# Altium project DKS.PrjPcb
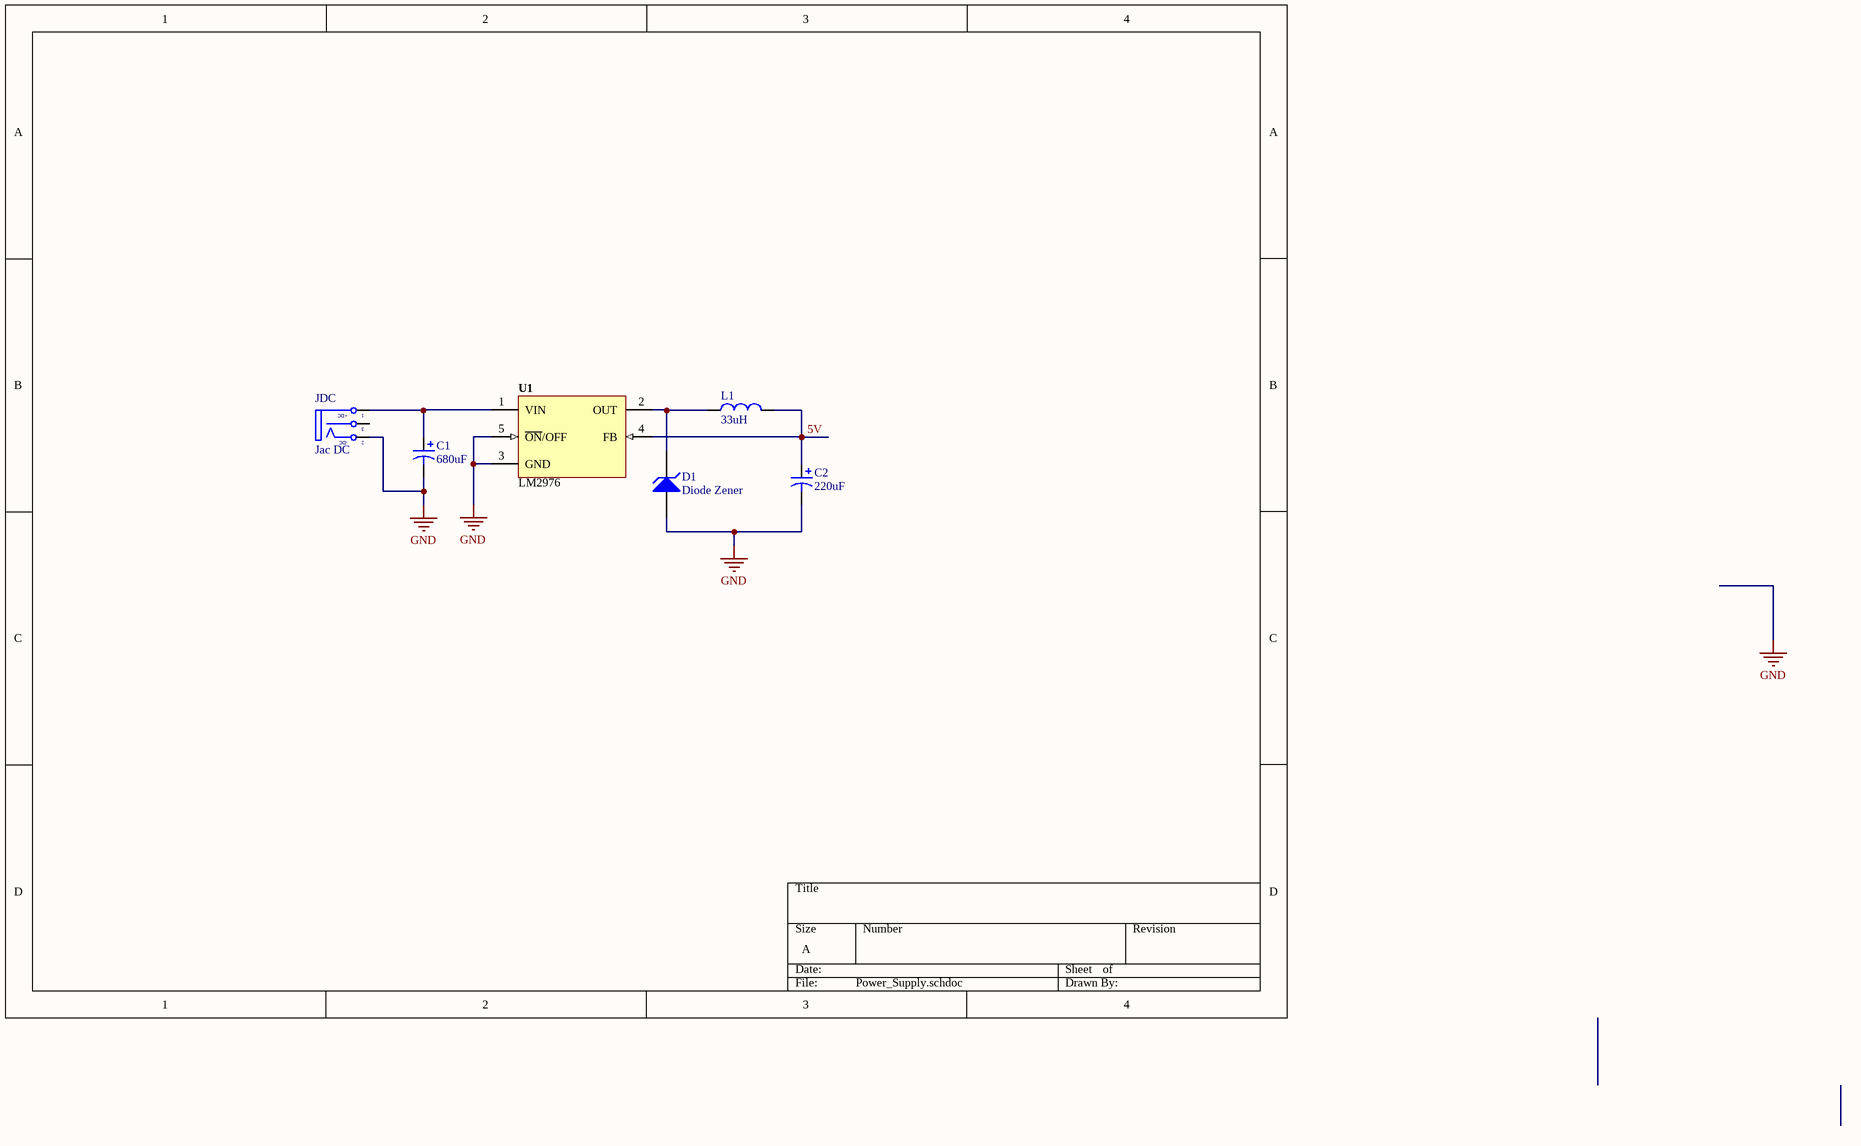
[diagram p0: Power_Supply.schdoc]
6 sheets, 59 parts. Net scope: global (net labels, ports and power ports of the same name join across sheets).
Board file: DigitalControl.PcbDoc
Sheets:
  Power_Supply.schdoc
  Driver.SchDoc
  IGBT.SchDoc
  Filter_Load.SchDoc
  Current_Voltage_Sensor.SchDoc
  MCU.SchDoc

## Sheet Power_Supply.schdoc
size A; SheetNumber: 1; SheetTotal: 6

### Parts
C1  680uF  [C5mm]
C2  220uF  [C5mm]
D1  Diode Zener  [SMA]
JDC  Jac DC  [DC0]
L1  33uH  [L-SMD-M-7.3x4.5]
U1  LM2976  [TO263]

### Nets
5V: C2.1 L1.2 U1.4(FB)
GND: C1.2 C2.2 D1.1(A) JDC.2(TN) U1.3(GND) U1.5(~{ON}/OFF)
NetC1_1: C1.1 JDC.1(T) U1.1(VIN)
NetD1_2: D1.2(K) L1.1 U1.2(OUT)

Not connected (* = marked no-connect by the designer): JDC 3(S)

### Notes on the sheet
- (in symbol DCIN) +DC; -DC

### Library data of the parts
C1 C2 = Cap Pol 5mm: Polarized Capacitor (Axial); Published: 8-Jun-2000; LatestRevisionDate: 17-Jul-2002; LatestRevisionNote: Re-released for DXP Platform.; PackageReference: POLAR0.8; Publisher: Altium Limited
D1 = Diode Zener: Zener Diode; Published: 8-Jun-2000; LatestRevisionDate: 17-Jul-2002; LatestRevisionNote: Re-released for DXP Platform.; PackageReference: DIODE-0.7; Publisher: Altium Limited
JDC = DCIN: Jac DC input; Value: Jac DC
L1 = L1: Inductor; Value: 150 mH
U1 = LM2596: Max Input Voltage: 12 V; Max Output Current: 3 (6.0 peak) A; Max Output Voltage: mV; Category: IC-Power; Min Input Voltage: mV; Min Output Voltage: mV; Mounting Technology: Surface Mount; Status: Unreleased; Supply Voltage: mV; Temperature Range: -40 to +125 degC

## Sheet Driver.SchDoc
size A; SheetNumber: 2; SheetTotal: 6
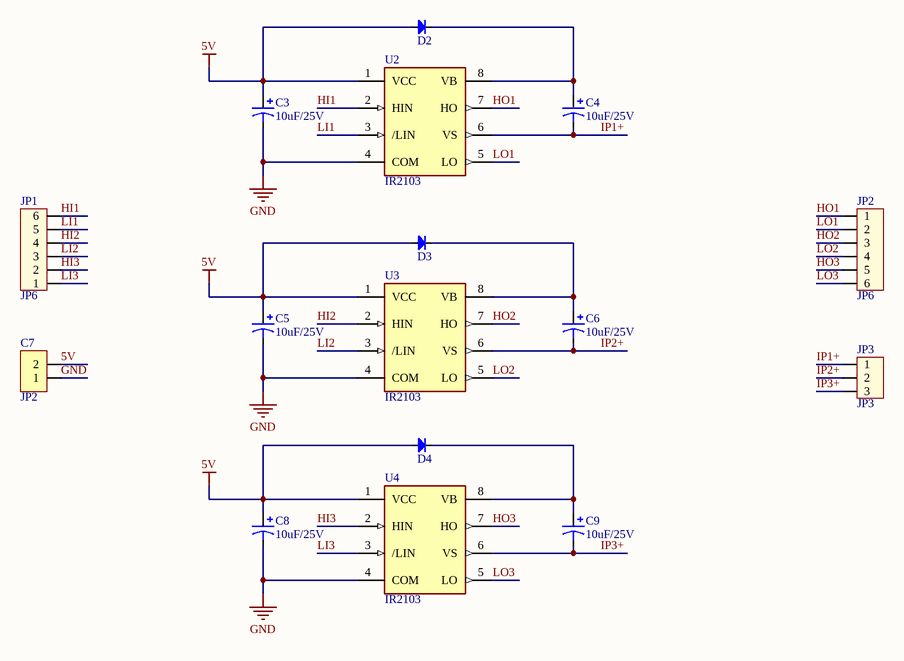
[diagram p1: Driver.SchDoc]

### Parts
C3  10uF/25V  [C3MM]
C4  10uF/25V  [C3MM]
C5  10uF/25V  [C3MM]
C6  10uF/25V  [C3MM]
C7  JP2  [JP2-C1T]
C8  10uF/25V  [C3MM]
C9  10uF/25V  [C3MM]
D2  Diode  [DIO-1A]  (value not drawn)
D3  Diode  [DIO-1A]  (value not drawn)
D4  Diode  [DIO-1A]  (value not drawn)
JP1  JP6  [CON6]
JP2  JP6  [CON6]
JP3  JP3  [CON3]
U2  IR2103  [DIL08]
U3  IR2103  [DIL08]
U4  IR2103  [DIL08]

### Nets
5V: C3.1 C5.1 C7.2 C8.1 D2.1(A) D3.1(A) D4.1(A) U2.1(VCC) U3.1(VCC) U4.1(VCC)
GND: C3.2 C5.2 C7.1 C8.2 U2.4(COM) U3.4(COM) U4.4(COM)
HI1: JP1.6 U2.2(HIN)
HI2: JP1.4 U3.2(HIN)
HI3: JP1.2 U4.2(HIN)
HO1: JP2.1 U2.7(HO)
HO2: JP2.3 U3.7(HO)
HO3: JP2.5 U4.7(HO)
IP1+: C4.2 JP3.1 U2.6(VS)
IP2+: C6.2 JP3.2 U3.6(VS)
IP3+: C9.2 JP3.3 U4.6(VS)
LI1: JP1.5 U2.3(/LIN)
LI2: JP1.3 U3.3(/LIN)
LI3: JP1.1 U4.3(/LIN)
LO1: JP2.2 U2.5(LO)
LO2: JP2.4 U3.5(LO)
LO3: JP2.6 U4.5(LO)
NetC4_1: C4.1 D2.2(K) U2.8(VB)
NetC6_1: C6.1 D3.2(K) U3.8(VB)
NetC9_1: C9.1 D4.2(K) U4.8(VB)

### Library data of the parts
C3-C6 C8 C9 = Cap Pol: Polarized Capacitor (Axial); Published: 8-Jun-2000; LatestRevisionDate: 17-Jul-2002; LatestRevisionNote: Re-released for DXP Platform.; PackageReference: POLAR0.8; Publisher: Altium Limited
C7 = JP2: WR-PHD 2.54 mm Angled Socket Header; Manufacturer: W¨¹rth Elektronik eiSos GmbH; partNo: 613002143121; ComponentLink1 Description: Manufacturer; ComponentLink2 Description: Datasheet; NoPins: 02; Created Date: 29 March 2013; ComponentLink1URL: http://www.we-online.com; ComponentLink2URL: http://katalog.we-online.de/em/datasheet/6130xx143121.pdf; Created by: Karrer Zheng
D2-D4 = Diode: Default Diode; Code - JEDEC: DO-214-AB; Value: 1N5007; Published: 8-Jun-2000; Revision: July-2002: Re-released for DXP Platform.; Publisher: Altium Limited
JP1 JP2 = Con6: Connector 6; Value: Connector 6
JP3 = Con3: Connector 3; Value: Connector 3
U2-U4 = IR2103: Half-Bridge Gate Driver IC Inverting, Non-Inverting 8-PDIP; MF: Infineon; Value: *; Availability: Unavailable; Price: None; Package: DIP-8 International Rectifier; MP: IR2103; SnapEDA_Link: https://www.snapeda.com/parts/IR2103/Infineon%20Technologies/view-part/41870/?ref=snap

## Sheet IGBT.SchDoc
size A; SheetNumber: 3; SheetTotal: 6
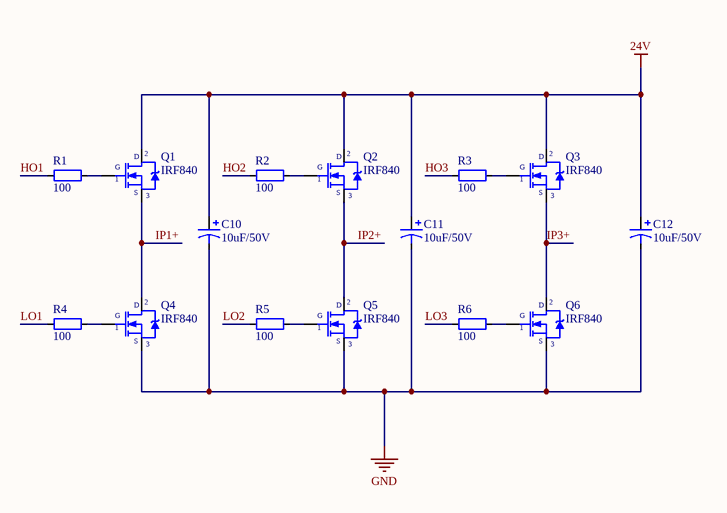
[diagram p2: IGBT.SchDoc]

### Parts
C10  10uF/50V  [C3MM]
C11  10uF/50V  [C3MM]
C12  10uF/50V  [C3MM]
Q1  IRF840  [QTO-220]
Q2  IRF840  [QTO-220]
Q3  IRF840  [QTO-220]
Q4  IRF840  [QTO-220]
Q5  IRF840  [QTO-220]
Q6  IRF840  [QTO-220]
R1  100  [RES-SMD-0101]
R2  100  [RES-SMD-0101]
R3  100  [RES-SMD-0101]
R4  100  [RES-SMD-0101]
R5  100  [RES-SMD-0101]
R6  100  [RES-SMD-0101]

### Nets
24V: C10.1 C11.1 C12.1 Q1.2(D) Q2.2(D) Q3.2(D)
GND: C10.2 C11.2 C12.2 Q4.3(S) Q5.3(S) Q6.3(S)
HO1: R1.1
HO2: R2.1
HO3: R3.1
IP1+: Q1.3(S) Q4.2(D)
IP2+: Q2.3(S) Q5.2(D)
IP3+: Q3.3(S) Q6.2(D)
LO1: R4.1
LO2: R5.1
LO3: R6.1
NetQ1_1: Q1.1(G) R1.2
NetQ2_1: Q2.1(G) R2.2
NetQ3_1: Q3.1(G) R3.2
NetQ4_1: Q4.1(G) R4.2
NetQ5_1: Q5.1(G) R5.2
NetQ6_1: Q6.1(G) R6.2

### Library data of the parts
C10-C12 = Cap Pol: Polarized Capacitor (Axial); Published: 8-Jun-2000; LatestRevisionDate: 17-Jul-2002; LatestRevisionNote: Re-released for DXP Platform.; PackageReference: POLAR0.8; Publisher: Altium Limited
Q1-Q6 = IRF840: MOSFET N - CHANNEL 500V - 0.75 - 8A - TO-220; Value: IRF840
R1-R6 = Resistor - SMD: Resistor; Manufacturer: Generic Components; Class: Passive; Published: 08/06/2000; Publisher: Altium Hobart Technology Centre

## Sheet Filter_Load.SchDoc
size A; SheetNumber: 4; SheetTotal: 6
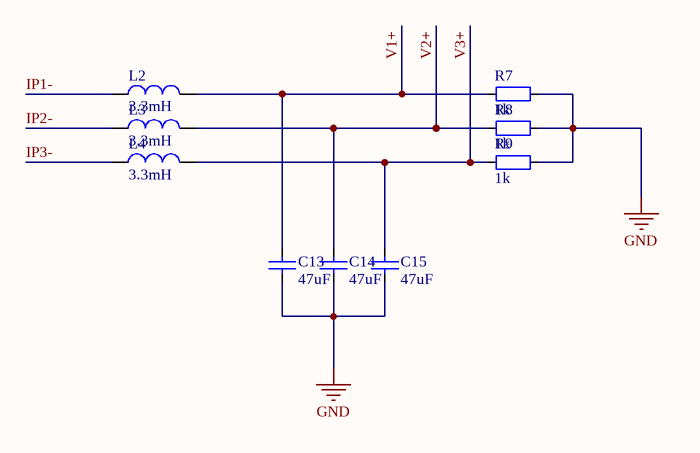
[diagram p3: Filter_Load.SchDoc]

### Parts
C13  47uF  [CAP_0402]
C14  47uF  [CAP_0402]
C15  47uF  [CAP_0402]
L2  3.3mH  [Inductor]
L3  3.3mH  [Inductor]
L4  3.3mH  [Inductor]
R7  1k  [RES-SMD-0101]
R8  1k  [RES-SMD-0101]
R9  1k  [RES-SMD-0101]

### Nets
GND: C13.1 C14.1 C15.1 R7.2 R8.2 R9.2
IP1-: L2.1
IP2-: L3.1
IP3-: L4.1
V1+: C13.2 L2.2 R7.1
V2+: C14.2 L3.2 R8.1
V3+: C15.2 L4.2 R9.1

### Library data of the parts
C13-C15 = CapSMD: Capacitor; Value: 33p; Published: 8-Jun-2000; LatestRevisionDate: 17-Jul-2002; LatestRevisionNote: Re-released for DXP Platform.; PackageReference: RAD-0.3; Publisher: Altium Limited
L2-L4 = Inductor: Value: 150 mH
R7-R9 = Resistor - SMD: as R1 on sheet IGBT; Published: 08/06/2000; Publisher: Altium Hobart Technology Centre

## Sheet Current_Voltage_Sensor.SchDoc
size A; SheetNumber: 5; SheetTotal: 6
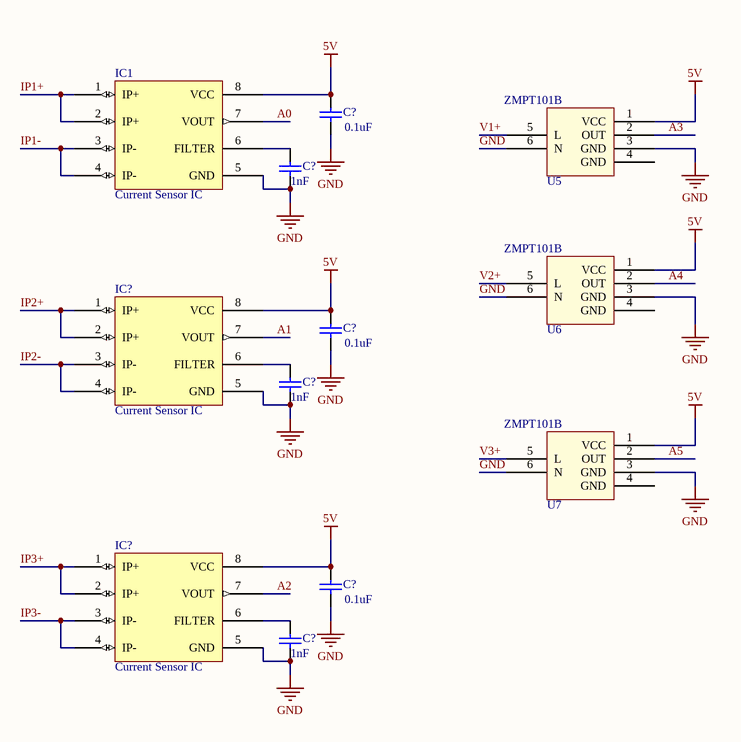
[diagram p4: Current_Voltage_Sensor.SchDoc]

### Parts
(Parts that share a designator on the sheet are numbered #1, #2 ... from top to bottom, then left to right.)
C?#1  0.1uF  [C0805]
C?#2  1nF  [C0805]
C?#3  0.1uF  [C0805]
C?#4  1nF  [C0805]
C?#5  0.1uF  [C0805]
C?#6  1nF  [C0805]
IC1  Current Sensor IC  [SO08]
IC?#1  Current Sensor IC  [SO08]
IC?#2  Current Sensor IC  [SO08]
U5  ZMPT101B  [XFMR_ZMPT101B]
U6  ZMPT101B  [XFMR_ZMPT101B]
U7  ZMPT101B  [XFMR_ZMPT101B]

### Nets
5V: C?#1.2 C?#3.2 C?#5.2 IC1.8(VCC) IC?#1.8(VCC) IC?#2.8(VCC) U5.1(VCC) U6.1(VCC) U7.1(VCC)
GND: C?#1.1 C?#2.1 C?#3.1 C?#4.1 C?#5.1 C?#6.1 IC1.5(GND) IC?#1.5(GND) IC?#2.5(GND) U5.3(GND) U5.6(N) U6.3(GND) U6.6(N) U7.3(GND) U7.6(N)
A0: IC1.7(VOUT)
A1: IC?#1.7(VOUT)
A2: IC?#2.7(VOUT)
A3: U5.2(OUT)
A4: U6.2(OUT)
A5: U7.2(OUT)
IP1+: IC1.1(IP+) IC1.2(IP+)
IP1-: IC1.3(IP-) IC1.4(IP-)
IP2+: IC?#1.1(IP+) IC?#1.2(IP+)
IP2-: IC?#1.3(IP-) IC?#1.4(IP-)
IP3+: IC?#2.1(IP+) IC?#2.2(IP+)
IP3-: IC?#2.3(IP-) IC?#2.4(IP-)
V1+: U5.5(L)
V2+: U6.5(L)
V3+: U7.5(L)
NetC?#2_2: C?#2.2 IC1.6(FILTER)
NetC?#4_2: C?#4.2 IC?#1.6(FILTER)
NetC?#6_2: C?#6.2 IC?#2.6(FILTER)

Not connected (* = marked no-connect by the designer): U5 4(GND); U6 4(GND); U7 4(GND)

### Library data of the parts
C?#1-C?#6 = CapSMD: Capacitor; Value: 33p; Published: 8-Jun-2000; LatestRevisionDate: 17-Jul-2002; LatestRevisionNote: Re-released for DXP Platform.; PackageReference: RAD-0.3; Publisher: Altium Limited
IC1 IC?#1 IC?#2 = ACS712

## Sheet MCU.SchDoc
size A; SheetNumber: 6; SheetTotal: 6
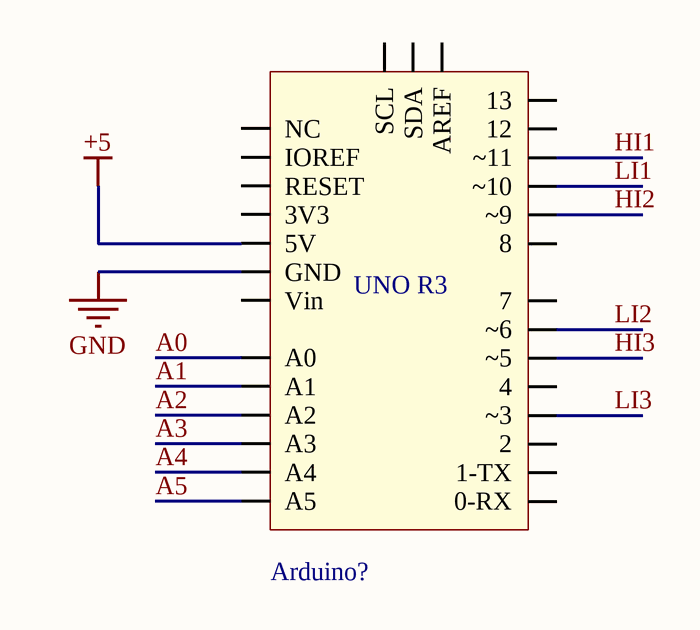
[diagram p5: MCU.SchDoc]

### Parts
Arduino?  Arduino Uno R3  [ARDUINO_A000066]  (value not drawn)

### Nets
+5: Arduino?.5V
GND: Arduino?.GND
A0: Arduino?.A0
A1: Arduino?.A1
A2: Arduino?.A2
A3: Arduino?.A3
A4: Arduino?.A4
A5: Arduino?.A5
HI1: Arduino?.~11
HI2: Arduino?.~9
HI3: Arduino?.~5
LI1: Arduino?.~10
LI2: Arduino?.~6
LI3: Arduino?.~3

Not connected (* = marked no-connect by the designer): Arduino? 0-RX 1-TX 2 3V3 4 7 8 12 13 AREF IOREF NC RESET SCL SDA Vin

### Notes on the sheet
- (in symbol Arduino Uno R3) UNO R3

### Library data of the parts
Arduino? = Arduino Uno R3: Value: Cau 1A

## Nets that join several sheets
5V: Power_Supply (C2.1 L1.2 U1.4), Driver (10 pins), Current_Voltage_Sensor (9 pins)
GND: Power_Supply (6 pins), Driver (7 pins), IGBT (6 pins), Filter_Load (6 pins), Current_Voltage_Sensor (15 pins), MCU (Arduino?.GND)
A0: Current_Voltage_Sensor (IC1.7), MCU (Arduino?.A0)
A1: Current_Voltage_Sensor (IC?#1.7), MCU (Arduino?.A1)
A2: Current_Voltage_Sensor (IC?#2.7), MCU (Arduino?.A2)
A3: Current_Voltage_Sensor (U5.2), MCU (Arduino?.A3)
A4: Current_Voltage_Sensor (U6.2), MCU (Arduino?.A4)
A5: Current_Voltage_Sensor (U7.2), MCU (Arduino?.A5)
HI1: Driver (JP1.6 U2.2), MCU (Arduino?.~11)
HI2: Driver (JP1.4 U3.2), MCU (Arduino?.~9)
HI3: Driver (JP1.2 U4.2), MCU (Arduino?.~5)
HO1: Driver (JP2.1 U2.7), IGBT (R1.1)
HO2: Driver (JP2.3 U3.7), IGBT (R2.1)
HO3: Driver (JP2.5 U4.7), IGBT (R3.1)
IP1+: Driver (C4.2 JP3.1 U2.6), IGBT (Q1.3 Q4.2), Current_Voltage_Sensor (IC1.1 IC1.2)
IP1-: Filter_Load (L2.1), Current_Voltage_Sensor (IC1.3 IC1.4)
IP2+: Driver (C6.2 JP3.2 U3.6), IGBT (Q2.3 Q5.2), Current_Voltage_Sensor (IC?#1.1 IC?#1.2)
IP2-: Filter_Load (L3.1), Current_Voltage_Sensor (IC?#1.3 IC?#1.4)
IP3+: Driver (C9.2 JP3.3 U4.6), IGBT (Q3.3 Q6.2), Current_Voltage_Sensor (IC?#2.1 IC?#2.2)
IP3-: Filter_Load (L4.1), Current_Voltage_Sensor (IC?#2.3 IC?#2.4)
LI1: Driver (JP1.5 U2.3), MCU (Arduino?.~10)
LI2: Driver (JP1.3 U3.3), MCU (Arduino?.~6)
LI3: Driver (JP1.1 U4.3), MCU (Arduino?.~3)
LO1: Driver (JP2.2 U2.5), IGBT (R4.1)
LO2: Driver (JP2.4 U3.5), IGBT (R5.1)
LO3: Driver (JP2.6 U4.5), IGBT (R6.1)
V1+: Filter_Load (C13.2 L2.2 R7.1), Current_Voltage_Sensor (U5.5)
V2+: Filter_Load (C14.2 L3.2 R8.1), Current_Voltage_Sensor (U6.5)
V3+: Filter_Load (C15.2 L4.2 R9.1), Current_Voltage_Sensor (U7.5)